# EAGLE schematic 2LD-17-mk-1.4.0 (EAGLE 7.5.0)
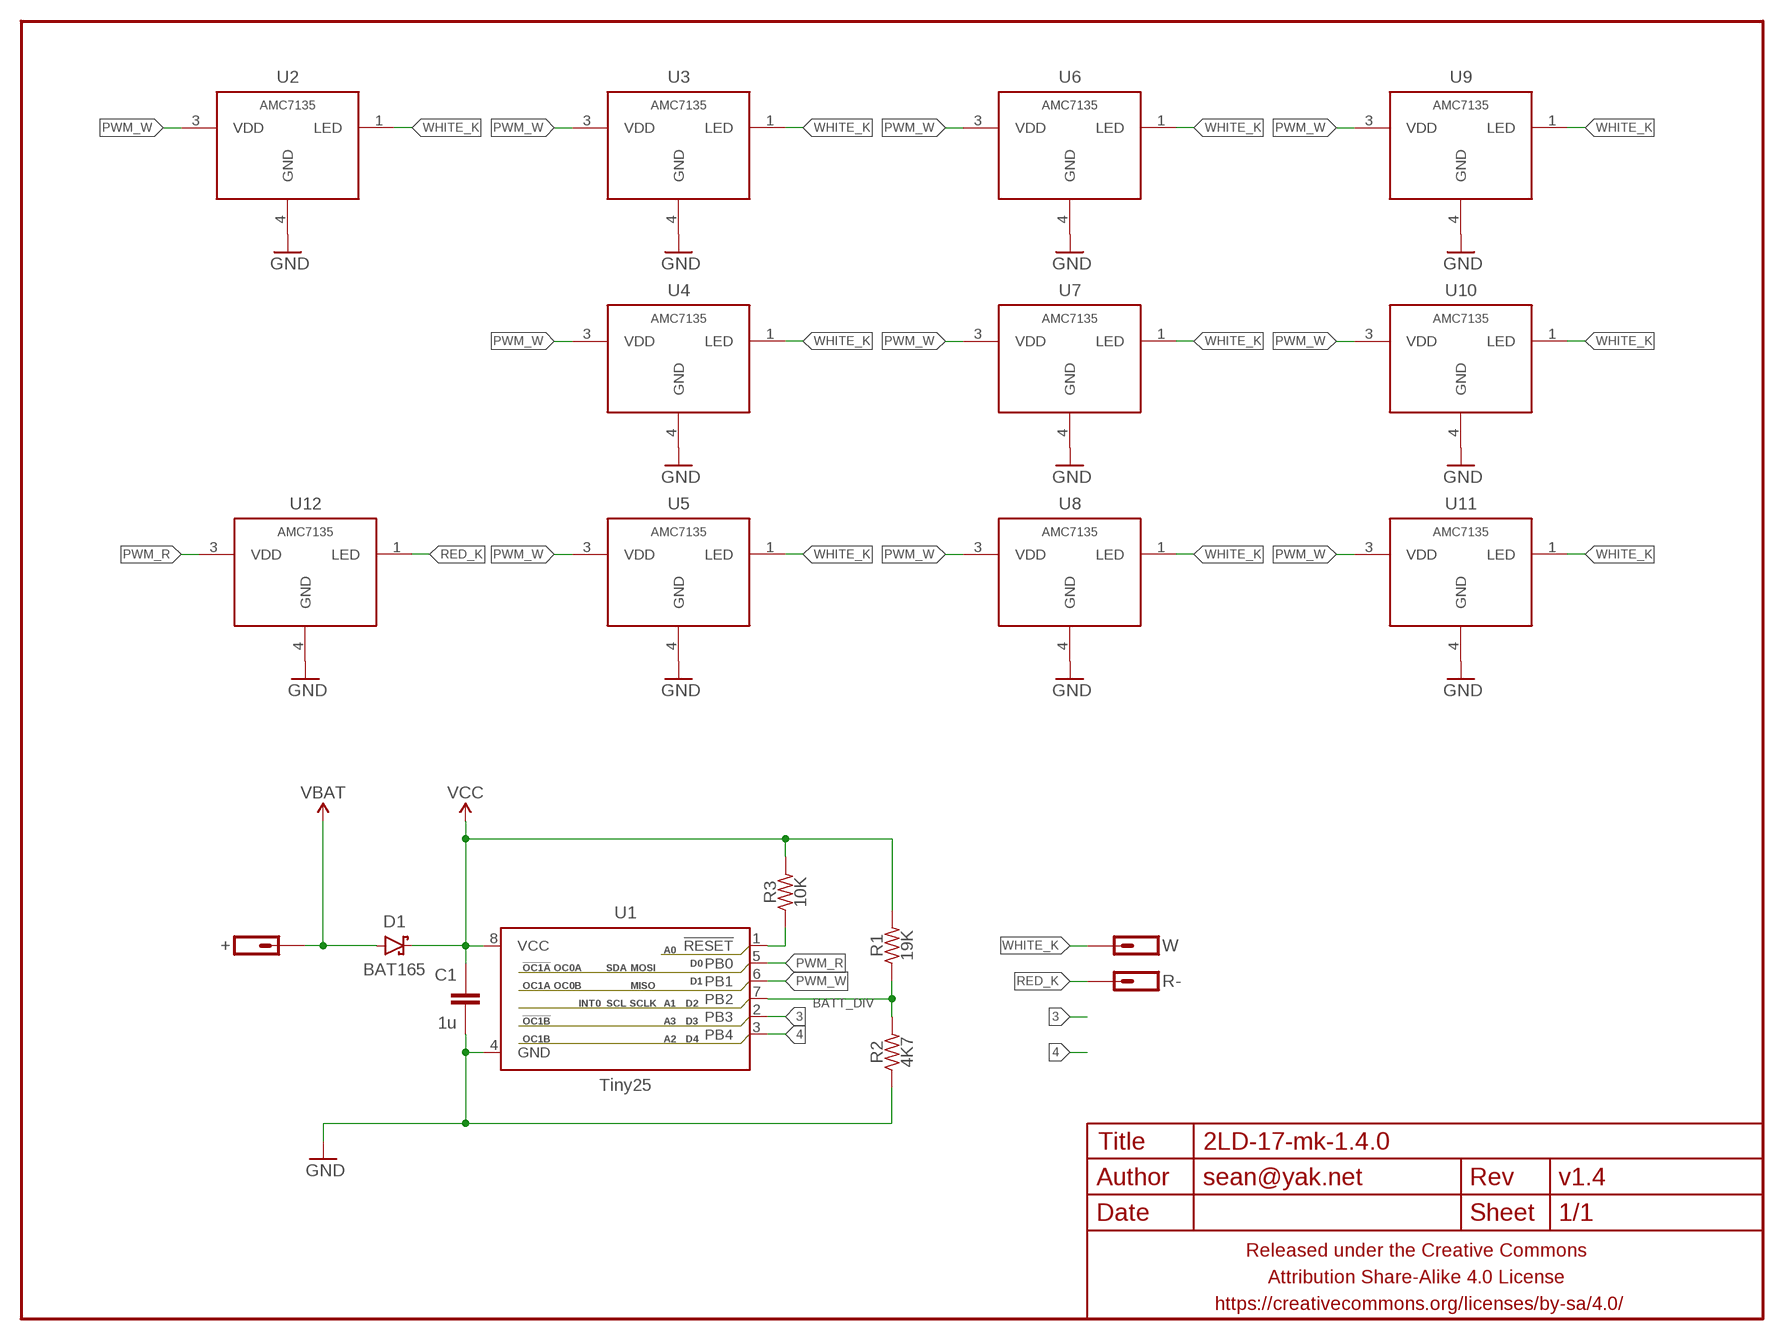
[diagram p0: schematic, sheet 1]

## Parts
+  M011X01-0.9MM-CIR  [1X01-0.9MM-CIR]
C1  1u  CAPACITOR-CERAMICC0402  [C0402]
D1  BAT165  DIODE-SCHOTTKYSOD323  [SOD323-SCHOTTKY]
FRAME1  FRAME-LETTERNO_PACKAGE  [DUMMY]
R1  19K  RESISTORR0402  [R0402]
R2  4K7  RESISTORR0402  [R0402]
R3  10K  RESISTORR0402  [R0402]
R-  M01SMD-1MM-DIA-NS  [1X01-SMD-1MM-DIA-NS]
U1  Tiny25  ATTINY13SOIC-NARROWPADS  [SO08-NARROWER]
U2  AMC7135  AMC7135SOT-89-NOTHERM-ROUNDED-LESS  [SOT89-NOTHERM-ROUNDED-LESS]
U3  AMC7135  AMC7135SOT-89-NOTHERM-ROUNDED-LESS  [SOT89-NOTHERM-ROUNDED-LESS]
U4  AMC7135  AMC7135SOT-89-NOTHERM-ROUNDED-LESS  [SOT89-NOTHERM-ROUNDED-LESS]
U5  AMC7135  AMC7135SOT-89-NOTHERM-ROUNDED-LESS  [SOT89-NOTHERM-ROUNDED-LESS]
U6  AMC7135  AMC7135SOT-89-NOTHERM-ROUNDED-LESS  [SOT89-NOTHERM-ROUNDED-LESS]
U7  AMC7135  AMC7135SOT-89-NOTHERM-ROUNDED-LESS  [SOT89-NOTHERM-ROUNDED-LESS]
U8  AMC7135  AMC7135SOT-89-NOTHERM-ROUNDED-LESS  [SOT89-NOTHERM-ROUNDED-LESS]
U9  AMC7135  AMC7135SOT-89-NOTHERM-ROUNDED-LESS  [SOT89-NOTHERM-ROUNDED-LESS]
U10  AMC7135  AMC7135SOT-89-NOTHERM-ROUNDED-LESS  [SOT89-NOTHERM-ROUNDED-LESS]
U11  AMC7135  AMC7135SOT-89-NOTHERM-ROUNDED-LESS  [SOT89-NOTHERM-ROUNDED-LESS]
U12  AMC7135  AMC7135SOT-89-NOTHERM-ROUNDED-LESS  [SOT89-NOTHERM-ROUNDED-LESS]
W  M011X01-0.9MM-CIR  [1X01-0.9MM-CIR]

## Nets
3: U1.2(PB3)
4: U1.3(PB4)
BATT_DIV: R1.1 R2.2 U1.7(PB2)
GND: C1.2 R2.1 U1.4(GND) U2.4(GND) U3.4(GND) U4.4(GND) U5.4(GND) U6.4(GND) U7.4(GND) U8.4(GND) U9.4(GND) U10.4(GND) U11.4(GND) U12.4(GND)
N$1: R3.1 U1.1(!RESET)
PWM_R: U1.5(PB0) U12.3(VDD)
PWM_W: U1.6(PB1) U2.3(VDD) U3.3(VDD) U4.3(VDD) U5.3(VDD) U6.3(VDD) U7.3(VDD) U8.3(VDD) U9.3(VDD) U10.3(VDD) U11.3(VDD)
RED_K: R-.P$1 U12.1(LED)
VBAT: +.P$1 D1.A
VCC: C1.1 D1.C R1.2 R3.2 U1.8(VCC)
WHITE_K: U2.1(LED) U3.1(LED) U4.1(LED) U5.1(LED) U6.1(LED) U7.1(LED) U8.1(LED) U9.1(LED) U10.1(LED) U11.1(LED) W.P$1

## Library data of the parts
+ R- W = a_parts:M01: Header 1 Standard 1-pin 0.1" header. Use with straight break away headers (SKU : PRT-00116), right angle break away headers (PRT-00553), swiss pins (PRT-00743), machine pins (PRT-00117), and female headers (PRT-00115).
C1 = a_parts:CAPACITOR-CERAMIC: CAPACITOR, European symbol
D1 = a_parts:DIODE-SCHOTTKY: Schottky diodes in SFE's production catalog BAT20J 1A 23V 0.62Vf RB751 120mA 40V 0.37Vf PMEG4005EJ 0.5A 40V 0.42Vf MBRA140 1A 40V 0.5Vf B340A 3A 40V SMA
FRAME1 = a_parts:FRAME-LETTER: Schematic Frame Standard 8.5x11 US Letter frame; DESIGNER: sean@yak.net; VERSION: v1.4
R1-R3 = a_parts:RESISTOR: RESISTOR, American symbol
U1 = a_parts:ATTINY13: Atmel 8-pin 1kB flash uC
U2-U12 = a_parts:AMC7135